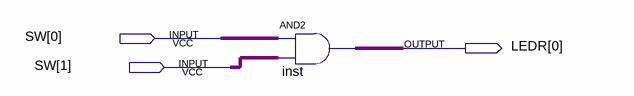
[diagram p0: schematic sheet]
// Quartus schematic Schematic.bdf as structural Verilog: 1 symbols, 3 pins
module Schematic (
  input  [1:0] SW,
  output [0:0] LEDR
);

  and inst (LEDR[0], SW[0], SW[1]);
endmodule
